# Altium schematic sheet Shema.SchDoc
size A
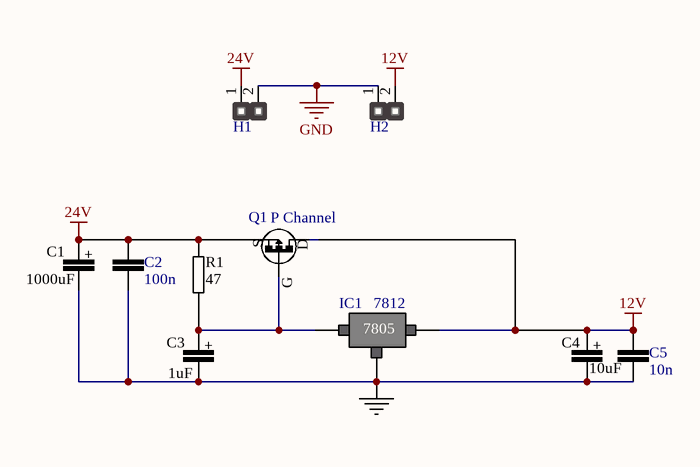
[diagram p0: Shema.SchDoc]

## Parts
C1  1000uF  [C2(elektrolit)]
C2  100n  [C1(ceramic)]
C3  1uF  [C1(ceramic)]
C4  10uF  [C2(elektrolit)]
C5  10n  [C1(ceramic)]
H1  Header1x2  [Header1x2]  (value not drawn)
H2  Header1x2  [Header1x2]  (value not drawn)
IC1  7812  [TO220]
Q1  P Channel  [TO220]
R1  47  [R1(300milsa)]

## Nets
12V: C4.1 C5.1 H2.2 IC1.3 Q1.2
24V: C1.1 C2.1 H1.1 Q1.3 R1.2
GND: C1.2 C2.2 C3.2 C4.2 C5.2 H1.2 H2.1 IC1.2
NetC3_1: C3.1 IC1.1 Q1.1 R1.1

## Notes on the sheet
- (in symbol C2) +
- (in symbol P-Channel MOSFET) S; D; G

## Library data of the parts
C1 C3 C4 = C2
C2 C5 = C1
IC1 = 7805
Q1 = P-Channel MOSFET
R1 = R1